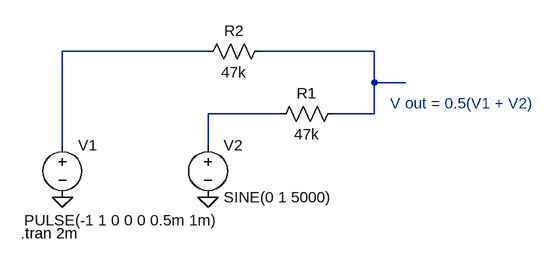
[diagram p0: schematic lab1 sumator.asc]
lab1 sumator.asc, the LTspice schematic file:
Version 4
SHEET 1 880 680
WIRE 256 16 32 16
WIRE 512 16 336 16
WIRE 512 64 512 16
WIRE 560 64 512 64
WIRE 368 112 256 112
WIRE 512 112 512 64
WIRE 512 112 448 112
WIRE 32 160 32 16
WIRE 256 160 256 112
FLAG 32 240 0
FLAG 256 240 0
SYMBOL voltage 32 144 R0
WINDOW 123 0 0 Left 2
WINDOW 39 0 0 Left 2
WINDOW 3 -59 132 Left 2
SYMATTR Value PULSE(-1 1 0 0 0 0.5m 1m)
SYMATTR InstName V1
SYMBOL voltage 256 144 R0
WINDOW 123 0 0 Left 2
WINDOW 39 0 0 Left 2
SYMATTR InstName V2
SYMATTR Value SINE(0 1 5000)
SYMBOL res 464 96 R90
WINDOW 0 0 56 VBottom 2
WINDOW 3 32 56 VTop 2
SYMATTR InstName R1
SYMATTR Value 47k
SYMBOL res 352 0 R90
WINDOW 0 0 56 VBottom 2
WINDOW 3 32 56 VTop 2
SYMATTR InstName R2
SYMATTR Value 47k
TEXT 536 96 Left 2 ;V out = 0.5(V1 + V2)
TEXT -32 296 Left 2 !.tran 2m

The netlist it stands for:
* lab1 sumator.asc
V1 N001 0 PULSE(-1 1 0 0 0 0.5m 1m)
V2 N003 0 SINE(0 1 5000)
R1 N002 N003 47k
R2 N002 N001 47k
* V out = 0.5(V1 + V2)
.tran 2m
.backanno
.end